# EasyEDA Pro project ProPrj_Electric_Dog.epro

# Schematic Schematic1
Board Name: Board1; Create Date: 2024-09-04
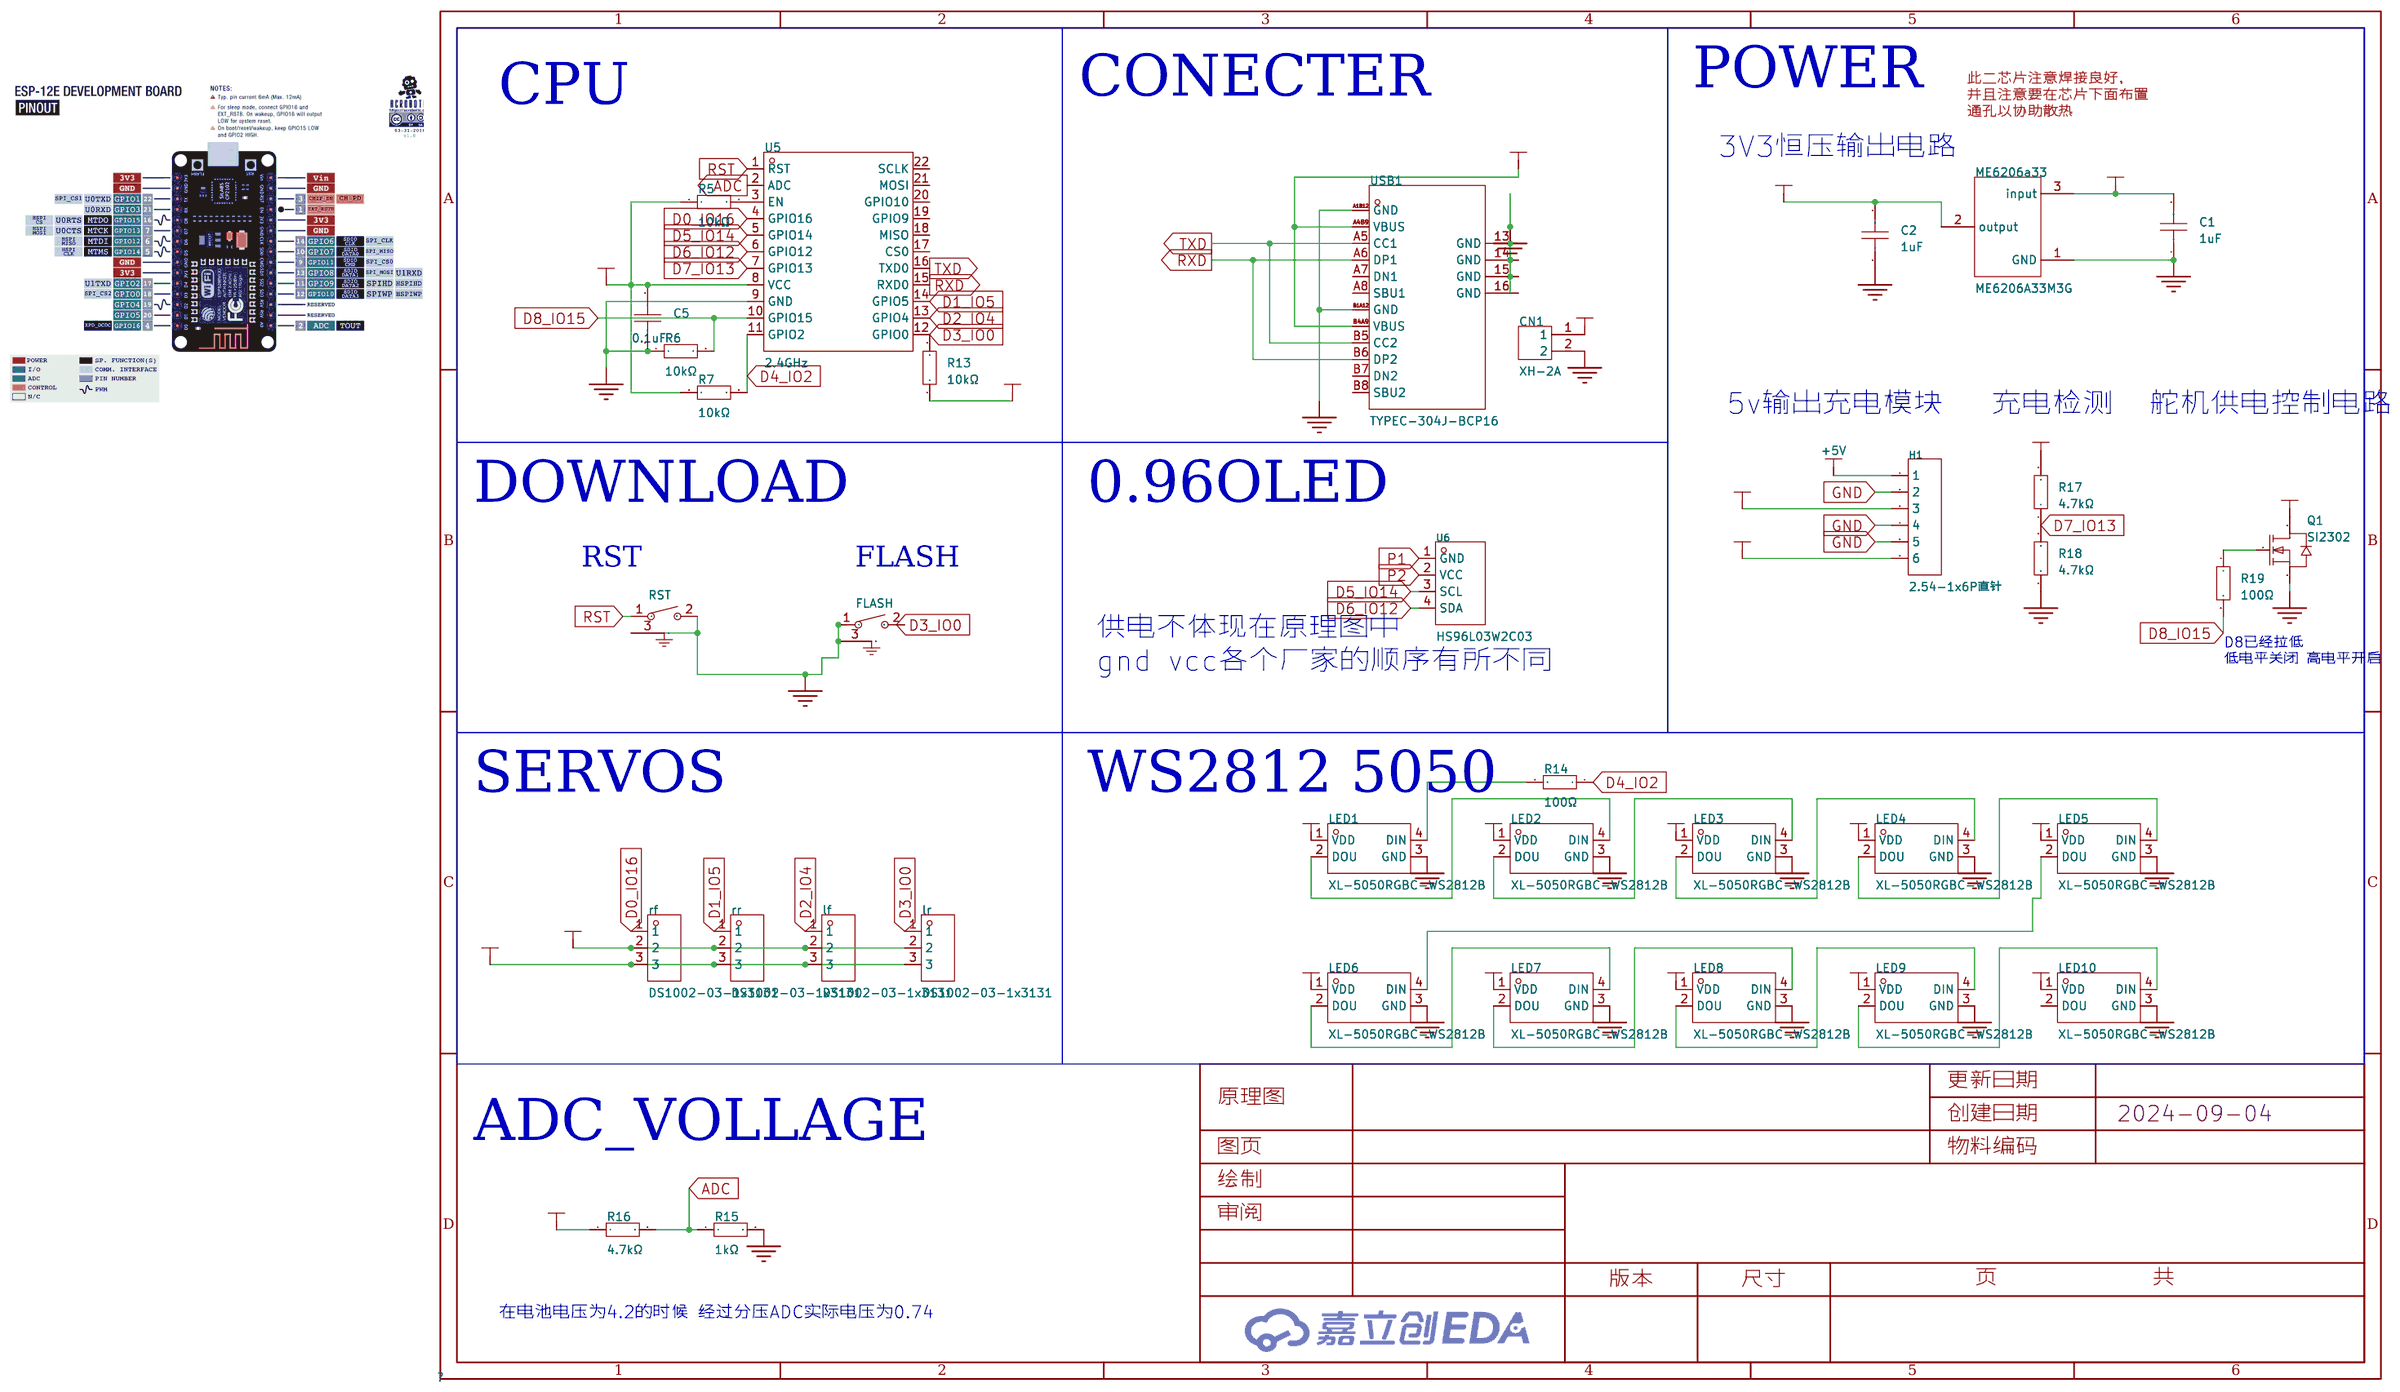
[diagram p0: schematic sheet]

## Parts
C1  1uF  [C0603]
C2  1uF  [C0603]
C5  0.1uF  [C0603]
CN1  XH-2A  [CONN-TH_XH-2A]
FLASH  TS-1091B-A8B3-D2  [KEY-TH_L4.5-W6.5-P3.10_TS-1091B-A8B3-D2]
H1  2.54-1x6P直针  [HDR-TH_6P-P2.54-V-M-1]
LED1  XL-5050RGBC-WS2812B  [LED-SMD_4P-L5.0-W5.0-BL_XL-5050RGBC]
LED2  XL-5050RGBC-WS2812B  [LED-SMD_4P-L5.0-W5.0-BL_XL-5050RGBC]
LED3  XL-5050RGBC-WS2812B  [LED-SMD_4P-L5.0-W5.0-BL_XL-5050RGBC]
LED4  XL-5050RGBC-WS2812B  [LED-SMD_4P-L5.0-W5.0-BL_XL-5050RGBC]
LED5  XL-5050RGBC-WS2812B  [LED-SMD_4P-L5.0-W5.0-BL_XL-5050RGBC]
LED6  XL-5050RGBC-WS2812B  [LED-SMD_4P-L5.0-W5.0-BL_XL-5050RGBC]
LED7  XL-5050RGBC-WS2812B  [LED-SMD_4P-L5.0-W5.0-BL_XL-5050RGBC]
LED8  XL-5050RGBC-WS2812B  [LED-SMD_4P-L5.0-W5.0-BL_XL-5050RGBC]
LED9  XL-5050RGBC-WS2812B  [LED-SMD_4P-L5.0-W5.0-BL_XL-5050RGBC]
LED10  XL-5050RGBC-WS2812B  [LED-SMD_4P-L5.0-W5.0-BL_XL-5050RGBC]
lf  DS1002-03-1x3131  [HDR-TH_3P-P2.54-V-M-1]
lr  DS1002-03-1x3131  [HDR-TH_3P-P2.54-V-M-1]
ME6206a33  ME6206A33M3G  [SOT-23-3_L2.9-W1.6-P1.90-LS2.8-BR]
Q1  SI2302  [SOT-23-3_L2.9-W1.3-P1.90-LS2.4-BR]
R5  10kΩ  [R0603]
R6  10kΩ  [R0603]
R7  10kΩ  [R0603]
R13  10kΩ  [R0603]
R14  100Ω  [R0603]
R15  1kΩ  [R0603]
R16  4.7kΩ  [R0603]
R17  4.7kΩ  [R0603]
R18  4.7kΩ  [R0603]
R19  100Ω  [R0603]
rf  DS1002-03-1x3131  [HDR-TH_3P-P2.54-V-M-1]
rr  DS1002-03-1x3131  [HDR-TH_3P-P2.54-V-M-1]
RST  TS-1091B-A8B3-D2  [KEY-TH_L4.5-W6.5-P3.10_TS-1091B-A8B3-D2]
U5  2.4GHz  [WIFIM-SMD_ESP-12F-ESP8266MOD]
U6  HS96L03W2C03  [OLED-TH_L27.8-W27.2-P2.54_C9900033791]
USB1  TYPEC-304J-BCP16  [USB-C-SMD_TYPEC-304J-BCP16]

## Library data of the parts
C1 C2 = CL10A105KB8NNNC: 容值:1uF;精度:±10%;额定电压:50V;材质(温度系数):X5R;; LCSC Part Name: 1uF ±10% 50V; Supplier Part: C15849; Manufacturer: SAMSUNG(三星); Supplier Footprint: 0603; JLCPCB Part Class: 基础库; Datasheet: https://atta.szlcsc.com/upload/public/pdf/source/20160218/1457707763339.pdf; Supplier: LCSC; Tolerance: ±10%; Voltage Rated: 50V; Temperature Coefficient: X5R
C5 = 0603BB104K500NGT: 容值:0.1uF;精度:±10%;额定电压:50V;温度系数:-;; LCSC Part Name: 0.1uF ±10% 50V; Supplier Part: C2168571; Manufacturer: Knowles(楼氏); Supplier Footprint: 0603; JLCPCB Part Class: 扩展库; Datasheet: https://atta.szlcsc.com/upload/public/pdf/source/20210426/55B82DB4A9EC19DEFEE13887341FCC08.pdf; Supplier: LCSC; Tolerance: ±10%; Voltage Rated: 50V
CN1 = XH-2A_C20079: 插针结构:1x2P;间距:2.5mm;安装方式:-;参考系列:XH;总PIN数:2P;排数:1;每排PIN数:2;行距:-;触头材质:-;; LCSC Part Name: 系列:XH 间距:2.5mm 1x2P; Supplier Part: C20079; Manufacturer: BOOMELE(博穆精密); Supplier Footprint: 插件,P=2.5mm; JLCPCB Part Class: 扩展库; Datasheet: https://atta.szlcsc.com/upload/public/pdf/source/20151225/1457707654857.pdf; Supplier: LCSC; Pins Structure: 1x2P; Pitch: 2.5mm; Reference Series: XH; Number of Pins: 2P; Number of Rows: 1; Number of PINs Per Row: 2
FLASH RST = TS-1091B-A8B3-D2: 电路结构:单刀单掷;安装方式:卧插;作用力:250gf@±30gf;机械寿命:-;带支架:否;; LCSC Part Name: 4.5*4.5*7mm 卧插 轻触开关; Supplier Part: C557914; Manufacturer: Yuandi(元迪); Supplier Footprint: 插件; JLCPCB Part Class: Extended Part; Datasheet: https://atta.szlcsc.com/upload/public/pdf/source/20200522/C557907_5E276C0BAE06263EE04F5DF3713DC068.pdf; Supplier: LCSC; Circuit: 单刀单掷; Mounting Style: 卧插; Actuator Style: 圆形按钮; Actuator/Cap Color: 黑色; Operating Force: 250gf@±30gf; Pin Style: PC引脚; Switch Length: 4.5mm; Switch Width: 4.5mm; Switch Height: 7mm; Strike Gundam: 否
H1 = 2.54-1x6P直针: 插针结构:1x6P;间距:2.54mm;行距:-;圆针/方针:方针;安装类型:直插;排数:单排;总PIN位数:6P;额定电流:3A;额定电压:-;配合针长度:-;塑高:-;触头材质:黄铜;触头镀层:-;工作温度范围:-40℃~+105℃;颜色:黑色;; LCSC Part Name: 间距:2.54mm 1x6P 直插 方针; Supplier Part: C37208; Manufacturer: BOOMELE(博穆精密); Supplier Footprint: 插件,P=2.54mm; JLCPCB Part Class: 扩展库; Supplier: LCSC; Pin Structure: 1x6P; Pitch: 2.54mm; Circluar Pins/Square Pins: 方针; Mounting Type: 直插; Number of Rows: 单排; Number of Pins: 6P; Current Rating (Max): 3A; Contact Material: 黄铜; Operating Temperature Range: -40℃~+105℃; Color: 黑色
LED1-LED10 = XL-5050RGBC-WS2812B: 5050七彩幻彩透明贴片LED灯珠 5050 幻彩透明四脚 ws2812B 内置驱动IC; Supplier Part: C2843785; Manufacturer: XINGLIGHT(成兴光); Supplier Footprint: SMD5050; JLCPCB Part Class: 扩展库; Datasheet: https://atta.szlcsc.com/upload/public/pdf/source/20240412/E1004CAA80592E31D08BFE019083806F.pdf; Supplier: LCSC
lf lr rf rr = DS1002-03-1x3131: 端子镀锡150u\"六爪镀金; Supplier Part: C7495244; Manufacturer: CONNFLY; Supplier Footprint: SIP-3; JLCPCB Part Class: 扩展库; Datasheet: https://atta.szlcsc.com/upload/public/pdf/source/20240329/0C4791BFD3969CFF9B8FE77E23916C14.pdf; Supplier: LCSC
ME6206a33 = ME6206A33M3G: 输出类型:固定;输出极性:正;最大输入电压:6V;输出电压:3.3V;输出电流:300mA;电源纹波抑制比(PSRR):50dB@(1kHz);; Supplier Part: C35259; Manufacturer: MICRONE(南京微盟); Supplier Footprint: SOT-23-3L; JLCPCB Part Class: 扩展库; Datasheet: https://atta.szlcsc.com/upload/public/pdf/source/20171014/C35259_15079757490131038524.pdf; Supplier: LCSC; Output Type: 固定; Output Polarity: 正; Number of Outputs: 1; Maximum Input Voltage: 6V; Output Voltage: 3.3V; Dropout Voltage: 380mV@(200mA); Output Current: 300mA; Power Supply Rejection Ratio (PSRR): 50dB@(1kHz)
Q1 = SI2302-HXY: 类型:1个N沟道;漏源电压(Vdss):20V;连续漏极电流(Id):2.8A;功率(Pd):900mW;导通电阻(RDS(on)@Vgs,Id):55mΩ@4.5V,2.8A;阈值电压(Vgs(th)@Id):1.2V@250uA;; LCSC Part Name: 1个N沟道 耐压:20V 电流:2.8A; Supplier Part: C4748714; Manufacturer: HXY MOSFET(华轩阳电子); Supplier Footprint: SOT-23; JLCPCB Part Class: 扩展库; Datasheet: https://atta.szlcsc.com/upload/public/pdf/source/20220720/B2EC63D46AD65363D9D3692163B46869.pdf; Supplier: LCSC; Type: 1个N沟道; Drain Source Voltage (Vdss): 20V; Continuous Drain Current (Id): 2.8A; Power Dissipation (Pd): 900mW; Drain Source On Resistance (RDS(on)@Vgs,Id): 55mΩ@4.5V,2.8A; Gate Threshold Voltage (Vgs(th)@Id): 1.2V@250uA; Input Capacitance (Ciss@Vds): 260pF@10V
R5-R7 R13 = 0603WAF1002T5E: 电阻类型:厚膜电阻;阻值:10kΩ;精度:±1%;功率:100mW;; LCSC Part Name: 厚膜电阻 10kΩ ±1% 100mW; Supplier Part: C25804; Manufacturer: UNI-ROYAL(厚声); Supplier Footprint: 0603; JLCPCB Part Class: Basic Part; Datasheet: https://atta.szlcsc.com/upload/public/pdf/source/20200306/C422600_1E6D84923E4A46A82E41ADD87F860B5C.pdf; Supplier: LCSC; Type: 厚膜电阻; Tolerance: ±1%; Power(Watts): 100mW; Temperature Coefficient: ±100ppm/℃; Overload Voltage (Max): 75V; Operating Temperature Range: -55℃~+155℃
R14 R19 = 0603WAF1000T5E: 电阻类型:厚膜电阻;阻值:100Ω;精度:±1%;功率:100mW;最大工作电压:75V;温度系数:±200ppm/℃;; LCSC Part Name: 100Ω ±1% 100mW 厚膜电阻; Supplier Part: C22775; Manufacturer: UNI-ROYAL(厚声); Supplier Footprint: 0603; JLCPCB Part Class: 基础库; Datasheet: https://atta.szlcsc.com/upload/public/pdf/source/20200306/C422600_1E6D84923E4A46A82E41ADD87F860B5C.pdf; Supplier: LCSC; Type: 厚膜电阻; Tolerance: ±1%; Power(Watts): 100mW; Overload Voltage (Max): 75V; Temperature Coefficient: ±200ppm/℃; Operating Temperature Range: -55℃~+155℃
R15 = 0603WAF1001T5E: 电阻类型:厚膜电阻;阻值:1kΩ;精度:±1%;功率:100mW;; LCSC Part Name: 1kΩ ±1% 100mW; Supplier Part: C21190; Manufacturer: UNI-ROYAL(厚声); Supplier Footprint: 0603; JLCPCB Part Class: Basic Part; Datasheet: https://atta.szlcsc.com/upload/public/pdf/source/20200306/C422600_1E6D84923E4A46A82E41ADD87F860B5C.pdf; Supplier: LCSC; Type: 厚膜电阻; Tolerance: ±1%; Power(Watts): 100mW; Temperature Coefficient: ±100ppm/℃; Overload Voltage (Max): 75V; Operating Temperature Range: -55℃~+155℃
R16-R18 = 0603WAF4701T5E: 电阻类型:厚膜电阻;阻值:4.7kΩ;精度:±1%;功率:100mW;最大工作电压:75V;温度系数:±100ppm/℃;; LCSC Part Name: 4.7kΩ ±1% 100mW 厚膜电阻; Supplier Part: C23162; Manufacturer: UNI-ROYAL(厚声); Supplier Footprint: 0603; JLCPCB Part Class: 基础库; Datasheet: https://atta.szlcsc.com/upload/public/pdf/source/20200306/C422600_1E6D84923E4A46A82E41ADD87F860B5C.pdf; Supplier: LCSC; Type: 厚膜电阻; Tolerance: ±1%; Power(Watts): 100mW; Overload Voltage (Max): 75V; Temperature Coefficient: ±100ppm/℃; Operating Temperature Range: -55℃~+155℃
U5 = ESP-12F(ESP8266MOD): 频率:2.4GHz;发射功率:16dBm;核心处理器:ESP8266;天线形式:PCB 板载天线;接收灵敏度:-90dBm;; LCSC Part Name: 完整的802.11b/g/nWi-Fi的SoC模块; Supplier Part: C82891; Manufacturer: Ai-Thinker(安信可); Supplier Footprint: SMD,16x24mm; JLCPCB Part Class: ExtendedPart; Datasheet: https://atta.szlcsc.com/upload/public/pdf/source/20210219/C82891_ABD84A460F4F056A2757267CCCA4B508.pdf; Supplier: LCSC; Output Power: 16dBm; Core Processor: ESP8266; Support Interface: GPIO；UART；I2C；PWM；SPI；ADC; Antenna Type: PCB板载天线; Wireless Standard: 802.11b/g/n; Operating Voltage: 3.3V; Receive  Current: 120mA; Send  Current: 170mA; Sensitivity: -90dBm; Operating Temperature: -40℃~+85℃
U6 = HS96L03W2C03: 尺寸(inch)：0.96寸 0.96' 像素分辨率：128x64 128*64主控芯片：SSD1315 接口类型：I2C 外形:27.3*27.8；IIC/3SPI/4SPI串口通讯,工作温度范围-40℃—+70℃。4PIN黑底白光。; LCSC Part Name: 0.96寸OLED显示屏窄白光IIC; Supplier Part: C5248080; Manufacturer: HS(汉昇); JLCPCB Part Class: Extended Part; Datasheet: https://atta.szlcsc.com/upload/public/pdf/source/20230627/763D01F79A90007632F098068C7C8AD9.pdf; Supplier: LCSC
USB1 = TYPEC-304J-BCP16: 连接器类型:Type-C;标准:USB 3.1;公母:母座;触点数量:16;端口数量:1;安装方式:卧贴;额定电流 - 电源:5A;工作温度范围:-40℃~+85℃;焊接温度(最大值):260℃;; LCSC Part Name: Type-C母座卧贴脚长2.0; Supplier Part: C2835315; Manufacturer: XUNPU(讯普); Supplier Footprint: SMD; JLCPCB Part Class: ExtendedPart; Datasheet: https://atta.szlcsc.com/upload/public/pdf/source/20210528/C2835315_A76BD3CF9329D12B6041421AD23BFD66.pdf; Supplier: LCSC; Connector Type: Type-C; Standard: USB3.1; Gender: 母座; Number of Contacts: 16; Number of Ports: 1; Mounting Style: 卧贴; Current Rating - Power (Max): 5A; Operating Temperature Range: -40℃~+85℃; Welding Temperature (Max): 260℃

## Nets
3V3: C2.2 C5.2 LED1.1(VDD) LED2.1(VDD) LED3.1(VDD) LED4.1(VDD) LED5.1(VDD) LED6.1(VDD) LED7.1(VDD) LED8.1(VDD) LED9.1(VDD) LED10.1(VDD) ME6206a33.2(output) R5.1 R7.1 R13.1 U5.8(VCC)
+5V: H1.1
GND: C1.1 C2.1 C5.1 CN1.2 FLASH.1 FLASH.3(GND) H1.2 H1.4 H1.5 LED1.3(GND) LED2.3(GND) LED3.3(GND) LED4.3(GND) LED5.3(GND) LED6.3(GND) LED7.3(GND) LED8.3(GND) LED9.3(GND) LED10.3(GND) ME6206a33.1(GND) Q1.2(S) R6.1 R15.2 R18.1 RST.2 RST.3(GND) U5.9(GND) USB1.13(GND) USB1.14(GND) USB1.15(GND) USB1.16(GND) USB1.A1B12(GND) USB1.B1A12(GND)
VIN: H1.6 R17.2 USB1.A4B9(VBUS) USB1.B4A9(VBUS)
ADC: R15.1 R16.2 U5.2(ADC)
BATTERY+: C1.2 CN1.1 H1.3 lf.2 lr.2 ME6206a33.3(input) R16.1 rf.2 rr.2
D0_IO16: rf.1 U5.4(GPIO16)
D1_IO5: rr.1 U5.14(GPIO5)
D2_IO4: lf.1 U5.13(GPIO4)
D3_IO0: FLASH.2 lr.1 R13.2 U5.12(GPIO0)
D4_IO2: R7.2 R14.1 U5.11(GPIO2)
D5_IO14: U5.5(GPIO14) U6.3(SCL)
D6_IO12: U5.6(GPIO12) U6.4(SDA)
D7_IO13: R17.1 R18.2 U5.7(GPIO13)
D8_IO15: R6.2 R19.2 U5.10(GPIO15)
P1: U6.1(GND)
P2: U6.2(VCC)
RST: RST.1 U5.1(RST)
RXD: U5.15(RXD0) USB1.A6(DP1) USB1.B6(DP2)
SERVOS_POWER: lf.3 lr.3 Q1.3(D) rf.3 rr.3
TXD: U5.16(TXD0) USB1.A5(CC1) USB1.B5(CC2)
$1N396: R5.2 U5.3(EN)
$1N3573: LED1.2(DOU) LED2.4(DIN)
$1N3873: LED2.2(DOU) LED3.4(DIN)
$1N3945: LED3.2(DOU) LED4.4(DIN)
$1N4017: LED4.2(DOU) LED5.4(DIN)
$1N4422: LED5.2(DOU) LED6.4(DIN)
$1N4734: LED6.2(DOU) LED7.4(DIN)
$1N4744: LED7.2(DOU) LED8.4(DIN)
$1N4754: LED8.2(DOU) LED9.4(DIN)
$1N4764: LED9.2(DOU) LED10.4(DIN)
$1N4854: LED1.4(DIN) R14.2
$1N12611: Q1.1(G) R19.1

Not connected (* = marked no-connect by the designer): LED10 2(DOU); U5 17(CS0) 18(MISO) 19(GPIO9) 20(GPIO10) 21(MOSI) 22(SCLK); USB1 A7(DN1) A8(SBU1) B7(DN2) B8(SBU2)

## Notes on the sheet
- CONECTER
- POWER
- CPU
- 此二芯片注意焊接良好，
  并且注意要在芯片下面布置
  通孔以协助散热
- 3V3恒压输出电路
- 5v输出充电模块
- 充电检测
- 舵机供电控制电路
- DOWNLOAD
- 0.96OLED
- RST
- FLASH
- D8已经拉低
  低电平关闭 高电平开启
- 供电不体现在原理图中
  gnd vcc各个厂家的顺序有所不同
- SERVOS
- WS2812 5050
- ADC_VOLLAGE
- 在电池电压为4.2的时候 经过分压ADC实际电压为0.74

# Board PCB1
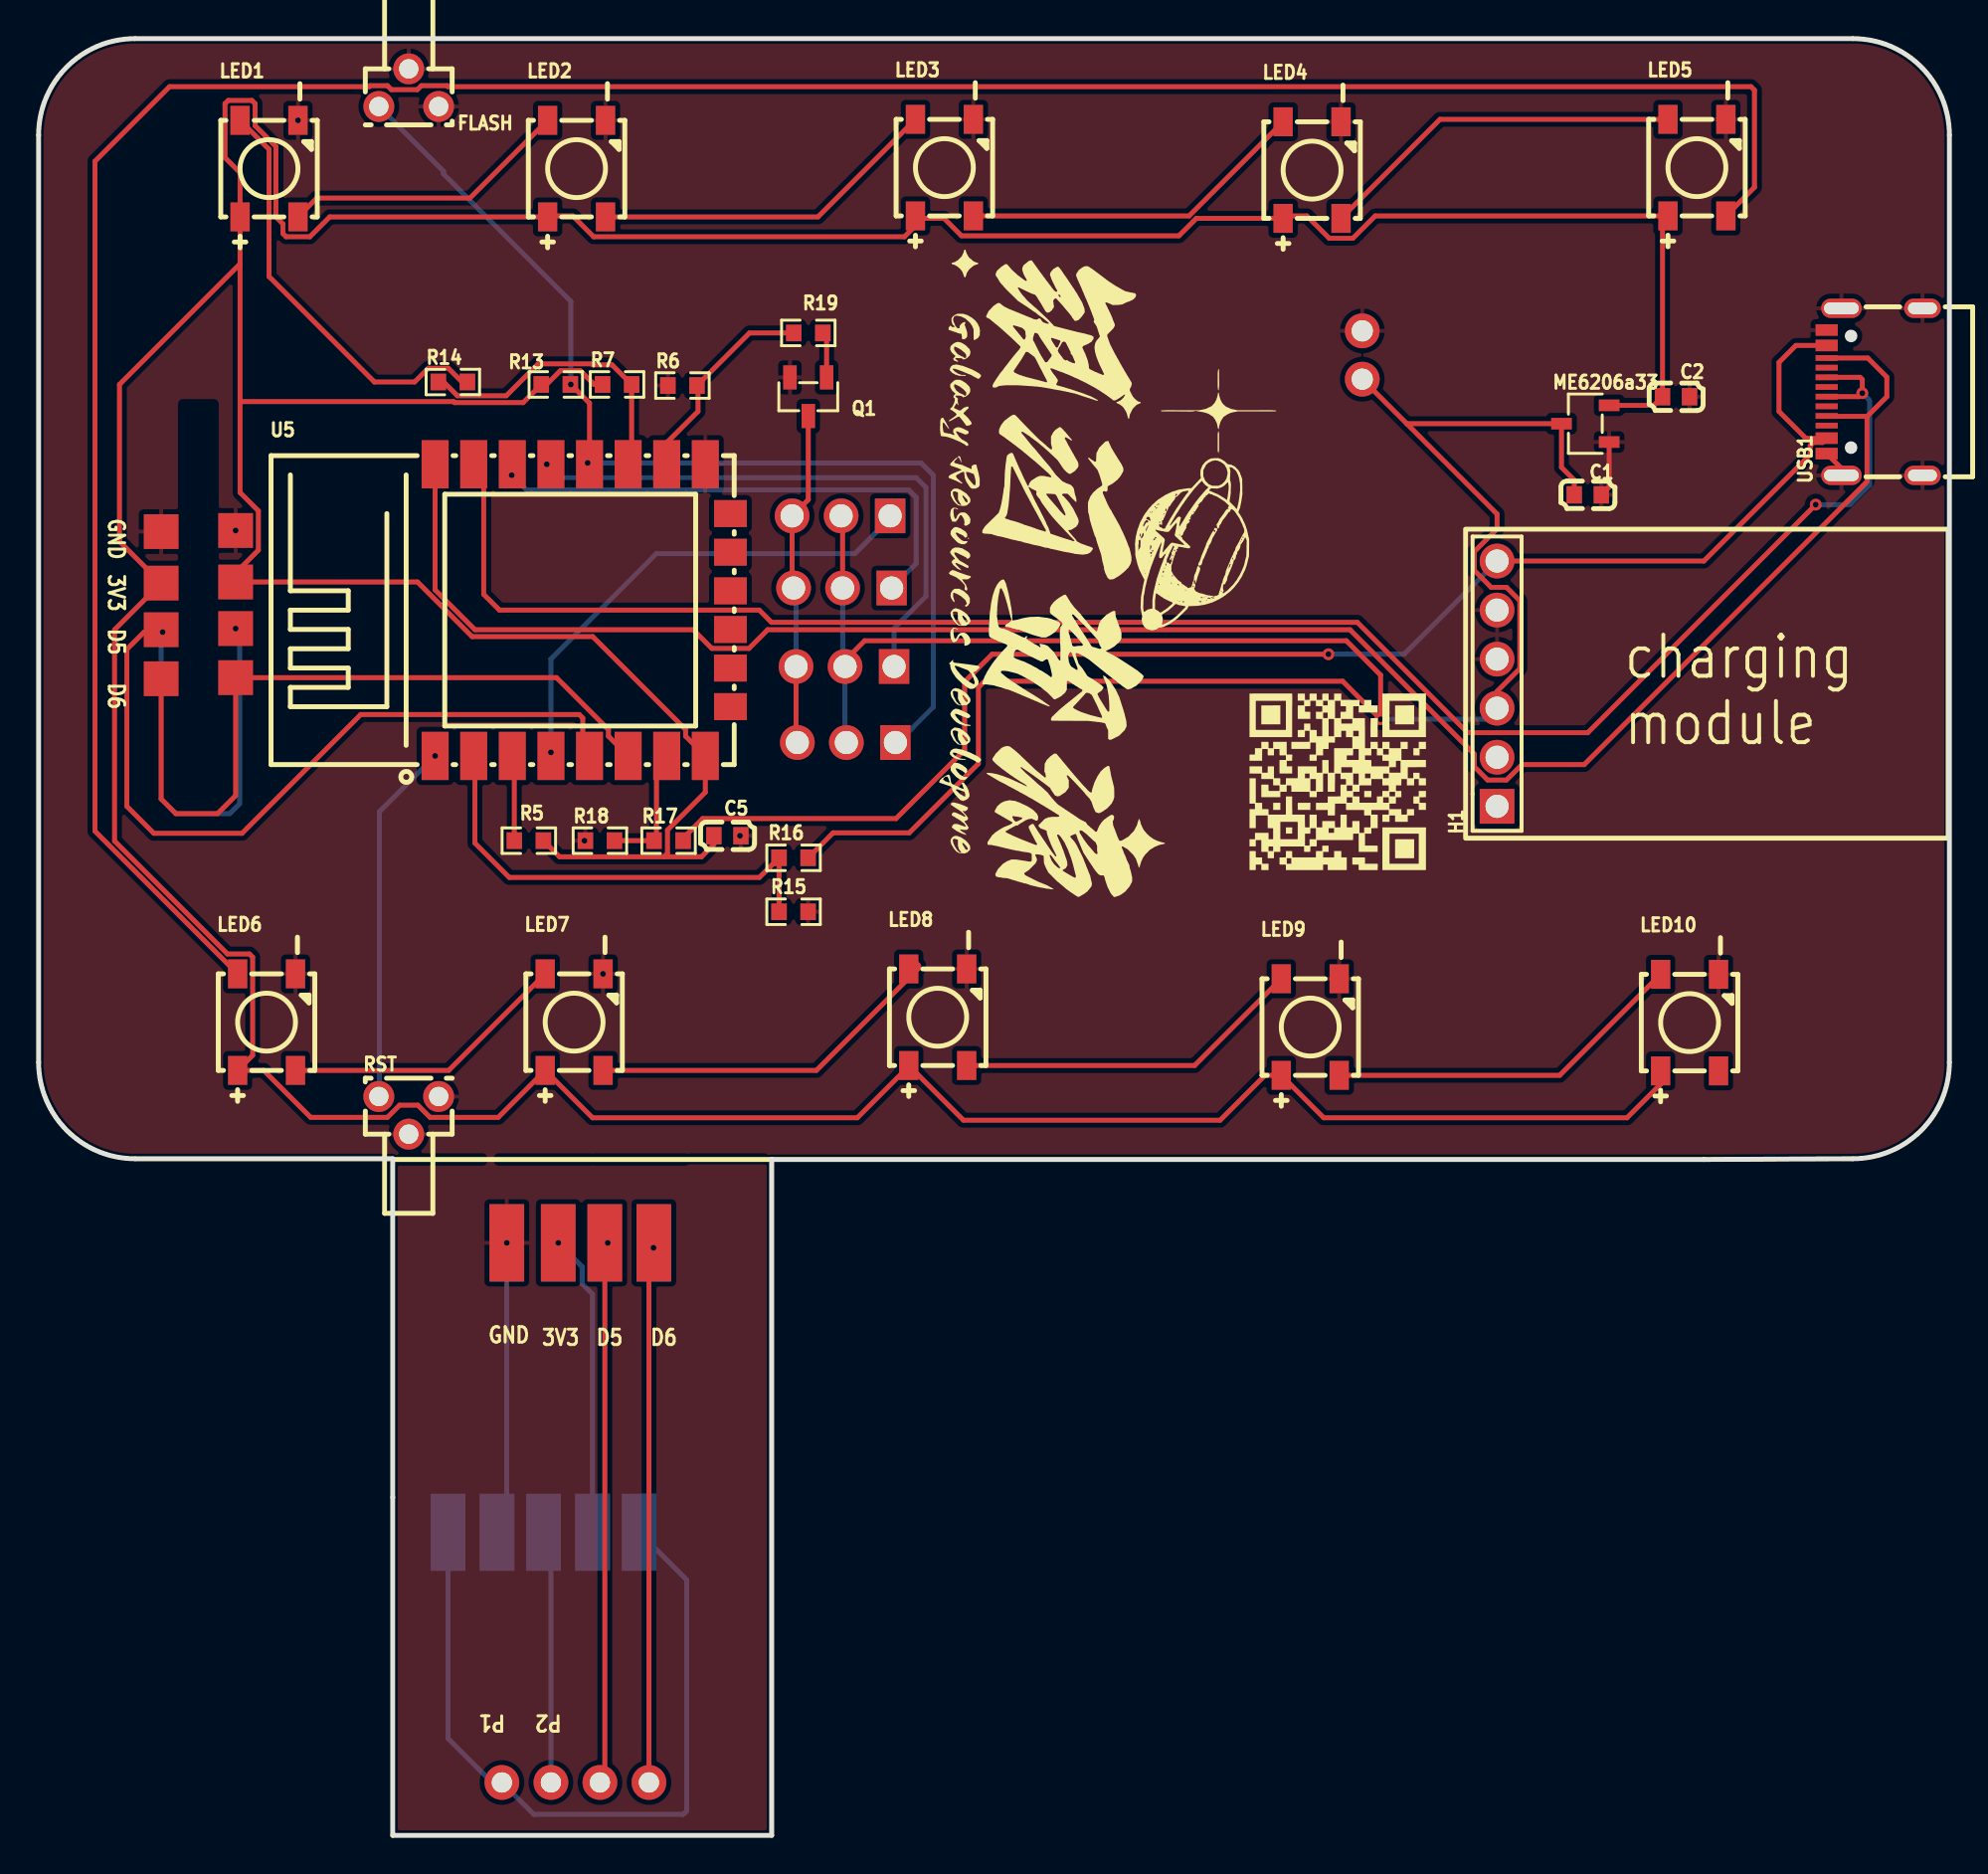
[diagram p1: board, top side]
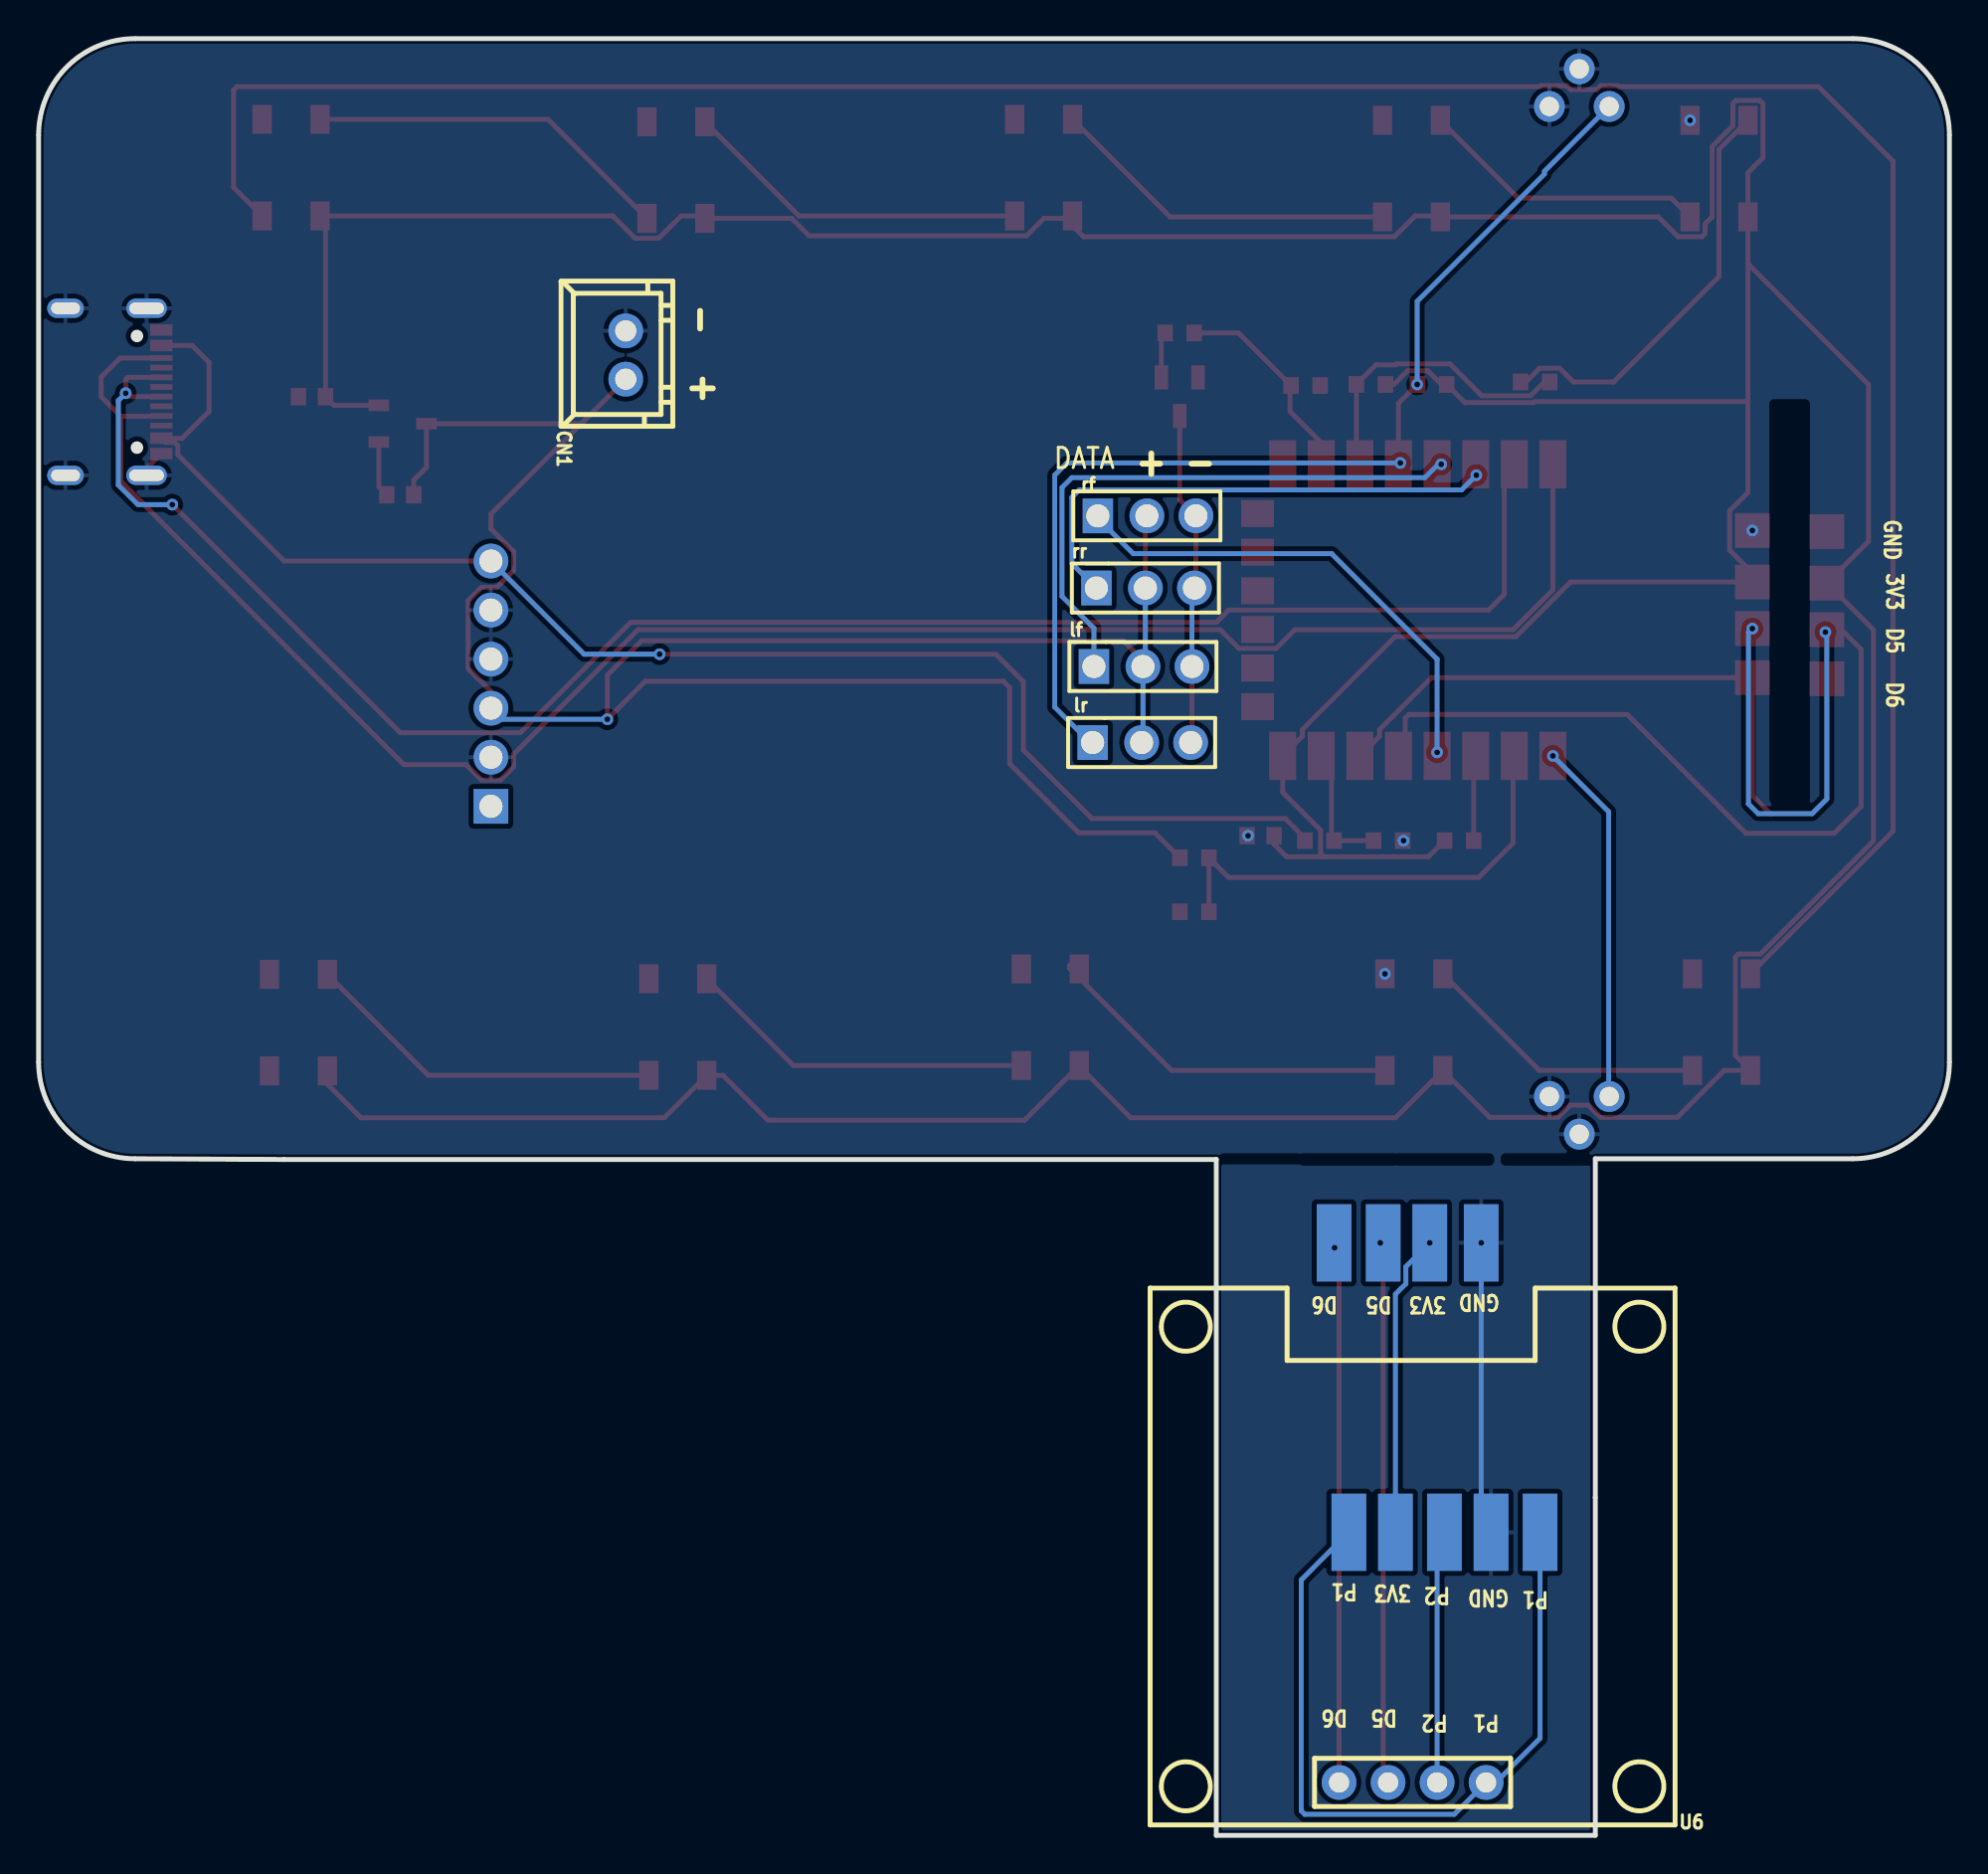
[diagram p2: board, bottom side, seen from below]

Outline 99 x 93.04 mm; copper layers: Top Layer, Bottom Layer. Coordinates in mm from the lower left corner of the outline.
Outline path: 0,88.04 arc(1.46,91.57) 5,93.04 94,93.04 arc(97.54,91.57) 99,88.04 99,40.04 arc(97.54,36.5) 94,35.04 86.29,35 37.98,35 37.98,0 18.35,0 18.35,35.04 5,35.04 arc(1.46,36.5) 0,40.04 0,88.04
Stack: Top Layer 0.035mm / Dielectric1 1.51mm FR4 er 4.5 / Bottom Layer 0.035mm

## Design rules (mm)
template: JLCPCB Capability(Two Layers Board)
spacing copperThickness1oz (default): track to track 0.102, other pairs 0.152 to 0.3
spacing copperThickness2oz: track to track 0.203, other pairs 0.152 to 0.3
track width copperThickness1oz (default): min 0.127, default 0.254, max 2.54
track width copperThickness2oz: min 0.203, default 0.254, max 2.54
differential pair differentialPair (default): width min 0.127, default 0.254, max 2.54; gap min 0.152, default 0.152
via viaSize (default): diameter min 0.5, default 0.61, max 10; hole min 0.3, default 0.305, max 6.3

## Placement (name value [footprint] x y rotation side)
C1  1uF  [C0603]  80.26 69.42 180 top
C2  1uF  [C0603]  84.84 74.5 180 top
C5  0.1uF  [C0603]  35.69 51.76 180 top
CN1  XH-2A  [CONN-TH_XH-2A]  68.58 76.65 90 bottom
FLASH  TS-1091B-A8B3-D2  [KEY-TH_L4.5-W6.5-P3.10_TS-1091B-A8B3-D2]  19.18 90.5 180 top
H1  2.54-1x6P直针  [HDR-TH_6P-P2.54-V-M-1]  75.56 59.64 90 top
LED1  XL-5050RGBC-WS2812B  [LED-SMD_4P-L5.0-W5.0-BL_XL-5050RGBC]  11.94 86.31 0 top
LED2  XL-5050RGBC-WS2812B  [LED-SMD_4P-L5.0-W5.0-BL_XL-5050RGBC]  27.87 86.31 0 top
LED3  XL-5050RGBC-WS2812B  [LED-SMD_4P-L5.0-W5.0-BL_XL-5050RGBC]  46.93 86.36 0 top
LED4  XL-5050RGBC-WS2812B  [LED-SMD_4P-L5.0-W5.0-BL_XL-5050RGBC]  65.98 86.23 0 top
LED5  XL-5050RGBC-WS2812B  [LED-SMD_4P-L5.0-W5.0-BL_XL-5050RGBC]  85.92 86.36 0 top
LED6  XL-5050RGBC-WS2812B  [LED-SMD_4P-L5.0-W5.0-BL_XL-5050RGBC]  11.81 42.11 0 top
LED7  XL-5050RGBC-WS2812B  [LED-SMD_4P-L5.0-W5.0-BL_XL-5050RGBC]  27.75 42.11 0 top
LED8  XL-5050RGBC-WS2812B  [LED-SMD_4P-L5.0-W5.0-BL_XL-5050RGBC]  46.58 42.36 0 top
LED9  XL-5050RGBC-WS2812B  [LED-SMD_4P-L5.0-W5.0-BL_XL-5050RGBC]  65.88 41.86 0 top
LED10  XL-5050RGBC-WS2812B  [LED-SMD_4P-L5.0-W5.0-BL_XL-5050RGBC]  85.54 42.09 0 top
lf  DS1002-03-1x3131  [HDR-TH_3P-P2.54-V-M-1]  41.78 60.53 180 bottom
lr  DS1002-03-1x3131  [HDR-TH_3P-P2.54-V-M-1]  41.85 56.59 180 bottom
ME6206a33  ME6206A33M3G  [SOT-23-3_L2.9-W1.6-P1.90-LS2.8-BR]  80.14 73.1 0 top
NOREF  -  [Pad_e440]  29.34 30.68 90 top
NOREF#2  -  [Pad_e446]  31.88 30.68 90 top
NOREF#3  -  [Pad_e88]  10.21 64.9 0 top
NOREF#4  -  [Pad_e432]  6.35 67.51 0 top
NOREF#5  -  [Pad_e89]  10.21 62.49 0 top
NOREF#6  -  [Pad_e436]  6.35 59.89 0 top
NOREF#7  -  [Pad_e472]  28.7 15.69 90 top
NOREF#8  -  [Pad_e438]  24.26 30.68 90 top
NOREF#9  -  [Pad_e441]  31.88 30.68 90 top
NOREF#10  -  [Pad_e467]  23.75 15.69 90 top
NOREF#11  -  [Pad_e473]  26.16 15.69 90 top
NOREF#12  -  [Pad_e474]  31.12 15.69 90 top
NOREF#13  -  [Pad_e434]  6.35 64.84 0 top
NOREF#14  -  [Pad_e90]  10.21 59.95 0 top
NOREF#15  -  [Pad_e87]  10.21 67.57 0 top
NOREF#16  -  [Pad_e447]  26.92 30.68 90 top
NOREF#17  -  [Pad_e444]  24.26 30.68 90 top
NOREF#18  -  [Pad_e445]  29.34 30.68 90 top
NOREF#19  -  [Pad_e466]  21.21 15.69 90 top
NOREF#20  -  [Pad_e439]  26.92 30.68 90 top
NOREF#21  -  [Pad_e435]  6.35 62.43 0 top
Q1  SI2302  [SOT-23-3_L2.9-W1.3-P1.90-LS2.4-BR]  39.88 74.5 90 top
R5  10kΩ  [R0603]  25.4 51.51 180 top
R6  10kΩ  [R0603]  33.36 75.07 0 top
R7  10kΩ  [R0603]  29.97 75.13 0 top
R13  10kΩ  [R0603]  26.8 75.13 0 top
R14  100Ω  [R0603]  21.46 75.26 0 top
R15  1kΩ  [R0603]  39.12 47.83 0 top
R16  4.7kΩ  [R0603]  39.12 50.62 180 top
R17  4.7kΩ  [R0603]  32.64 51.51 0 top
R18  4.7kΩ  [R0603]  29.08 51.51 0 top
R19  100Ω  [R0603]  39.88 77.8 180 top
rf  DS1002-03-1x3131  [HDR-TH_3P-P2.54-V-M-1]  41.58 68.33 180 bottom
rr  DS1002-03-1x3131  [HDR-TH_3P-P2.54-V-M-1]  41.66 64.59 180 bottom
RST  TS-1091B-A8B3-D2  [KEY-TH_L4.5-W6.5-P3.10_TS-1091B-A8B3-D2]  19.18 37.28 0 top
U5  2.4GHz  [WIFIM-SMD_ESP-12F-ESP8266MOD]  28.19 63.45 0 top
U6  HS96L03W2C03  [OLED-TH_L27.8-W27.2-P2.54_C9900033791]  27.81 2.74 0 bottom
USB1  TYPEC-304J-BCP16  [USB-C-SMD_TYPEC-304J-BCP16]  95.12 74.75 90 top

## Footprints (pads in the part's own frame, mm; a bottom-side part is the same pattern mirrored in y, then rotated)
C0603
  rect 0.8x0.9 smd: 1(-0.7,0) 2(0.7,0)
CONN-TH_XH-2A
  round 1.8 hole 1.1: 1(-1.251,0) 2(1.251,0)
HDR-TH_3P-P2.54-V-M-1
  rect 1.575x1.8 hole 1.2: 1(-2.54,0)
  round 1.8 hole 1.2: 2(0,0) 3(2.54,0)
HDR-TH_6P-P2.54-V-M-1
  rect 1.8x1.8 hole 1.2: 1(-6.35,0)
  round 1.8 hole 1.2: 2(-3.81,0) 3(-1.27,0) 4(1.27,0) 5(3.81,0) 6(6.35,0)
KEY-TH_L4.5-W6.5-P3.10_TS-1091B-A8B3-D2
  round 1.6 hole 1: 1(-1.55,0.975) 2(1.55,0.975) 3(0,-0.975)
LED-SMD_4P-L5.0-W5.0-BL_XL-5050RGBC
  rect 1x1.5 smd: 1(-1.5,-2.5) 2(1.5,-2.5) 3(1.5,2.5) 4(-1.5,2.5)
OLED-TH_L27.8-W27.2-P2.54_C9900033791
  round 1.8 hole 1.05: 1(-3.81,0) 2(-1.27,0) 3(1.27,0) 4(3.81,0)
Pad_e87
  rect 1.8x1.8 smd: 1(0,0)
Pad_e88
  rect 1.8x1.8 smd: 1(0,0)
Pad_e89
  rect 1.8x1.8 smd: 1(0,0)
Pad_e90
  rect 1.8x1.8 smd: 1(0,0)
Pad_e432
  rect 1.8x1.8 smd: 1(0,0)
Pad_e434
  rect 1.8x1.8 smd: 1(0,0)
Pad_e435
  rect 1.8x1.8 smd: 1(0,0)
Pad_e436
  rect 1.8x1.8 smd: 1(0,0)
Pad_e438
  rect 4x1.8 smd: 1(0,0)
Pad_e439
  rect 4x1.8 smd: 1(0,0)
Pad_e440
  rect 4x1.8 smd: 1(0,0)
Pad_e441
  rect 4x1.8 smd: 1(0,0)
Pad_e444
  rect 4x1.8 smd far side: 1(0,0)
Pad_e445
  rect 4x1.8 smd far side: 1(0,0)
Pad_e446
  rect 4x1.8 smd far side: 1(0,0)
Pad_e447
  rect 4x1.8 smd far side: 1(0,0)
Pad_e466
  rect 4x1.8 smd far side: 1(0,0)
Pad_e467
  rect 4x1.8 smd far side: 1(0,0)
Pad_e472
  rect 4x1.8 smd far side: 1(0,0)
Pad_e473
  rect 4x1.8 smd far side: 1(0,0)
Pad_e474
  rect 4x1.8 smd far side: 1(0,0)
R0603
  rect 0.806x0.864 smd: 1(-0.753,0) 2(0.753,0)
SOT-23-3_L2.9-W1.3-P1.90-LS2.4-BR
  rect 1.25x0.7 smd: 1(1,-0.95) 2(1,0.95) 3(-1,0)
SOT-23-3_L2.9-W1.6-P1.90-LS2.8-BR
  rect 1.07x0.6 smd: 1(1.235,-0.95) 2(1.235,0.95) 3(-1.235,0)
USB-C-SMD_TYPEC-304J-BCP16
  oval 1x2.1 hole 0.6x1.8: 13(-4.325,1.718) 14(4.325,1.718)
  oval 1x1.9 hole 0.6x1.5: 15(-4.325,-2.482) 16(4.325,-2.482)
  rect 0.6x1.15 smd: A1B12(-3.2,2.482) A4B9(-2.4,2.482) B1A12(3.2,2.482) B4A9(2.4,2.482)
  rect 0.3x1.15 smd: A5(-1.25,2.482) A6(-0.25,2.482) A7(0.25,2.482) A8(1.25,2.482) B5(1.75,2.482) B6(0.75,2.482) B7(-0.75,2.482) B8(-1.75,2.482)
WIFIM-SMD_ESP-12F-ESP8266MOD
  rect 1.4x2.5 smd: 1(-7.651,-7.551) 2(-5.651,-7.551) 3(-3.651,-7.551) 4(-1.651,-7.551) 5(0.349,-7.551) 6(2.349,-7.551) 7(4.349,-7.551) 8(6.349,-7.551) 9(6.349,7.548) 10(4.349,7.55) 11(2.349,7.551) 12(0.349,7.551) 13(-1.651,7.55) 14(-3.651,7.551) 15(-5.651,7.551) 16(-7.651,7.551)
  rect 1.7x1.4 smd: 17(7.651,-5) 18(7.649,-3.002) 19(7.649,-1.004) 20(7.649,0.998) 21(7.649,2.997) 22(7.651,4.997)

## Nets
As in the schematic, except:
3V3: C2.2 C5.2 LED1.1 LED2.1 LED3.1 LED4.1 LED5.1 LED6.1 LED7.1 LED8.1 LED9.1 LED10.1 ME6206a33.2 NOREF#3.1 NOREF#7.1 NOREF#13.1 NOREF#16.1 NOREF#20.1 R5.1 R7.1 R13.1 U5.8
GND: C1.1 C2.1 C5.1 CN1.2 FLASH.1 FLASH.3 H1.2 H1.4 H1.5 LED1.3 LED2.3 LED3.3 LED4.3 LED5.3 LED6.3 LED7.3 LED8.3 LED9.3 LED10.3 ME6206a33.1 NOREF#4.1 NOREF#8.1 NOREF#10.1 NOREF#15.1 NOREF#17.1 Q1.2 R6.1 R15.2 R18.1 RST.2 RST.3 U5.9 USB1.13 USB1.14 USB1.15 USB1.16 USB1.A1B12 USB1.B1A12
D5_IO14: NOREF.1 NOREF#5.1 NOREF#18.1 NOREF#21.1 U5.5 U6.3
D6_IO12: NOREF#2.1 NOREF#6.1 NOREF#9.1 NOREF#14.1 U5.6 U6.4
P1: NOREF#12.1 NOREF#19.1 U6.1
P2: NOREF#11.1 U6.2

Pads without a net: LED10 2; U5 17 18 19 20 21 22; USB1 A7 A8 B7 B8

## Via types
v1: diameter 0.61, hole 0.305, Top Layer to Bottom Layer, 21 vias

## Routing (per net, layer and track width the routed paths; a pad name or vN(x,y) marks a point on that pad's centre or on a via; arc(x,y) is an arc through that point)
3V3: length 335.6
  Top Layer w0.254: 10.44,81.38 4.19,75.13 4.19,67 NOREF#13.1 3.94,62.43 3.94,51.49 9.79,45.64 10.93,45.64 11.09,45.48 11.09,40.39 LED6.1 11.67,39.61 14.1,37.18 18.07,37.18 18.71,37.81 19.65,37.81 20.28,37.18 23.82,37.18 LED7.1 28.7,37.16 42.42,37.16 45.08,39.82 LED8.1 47.92,37.03 61.21,37.03 63.54,39.36 LED9.1 66.58,37.16 82.3,37.16 84.04,38.9 LED10.1 ; 10.44,81.38 10.44,74.24 ; 10.44,81.38 LED1.1 10.44,86.09 9.66,86.87 9.66,89.67 9.82,89.84 11.05,89.84 11.22,89.67 11.22,88.53 12.29,87.45 12.29,83.81 12.66,83.44 12.66,82.94 12.82,82.78 14.05,82.78 15.08,83.81 LED2.1 26.42,83.86 27.68,83.86 28.76,82.78 44.86,82.78 45.43,83.35 LED3.1 45.56,83.73 46.91,83.73 47.81,82.83 59.08,82.83 59.98,83.73 LED4.1 64.61,83.86 65.71,83.86 66.86,82.7 68.1,82.7 69.25,83.86 LED5.1 84.14,83.57 C2.2 83.69,74.05 ME6206a33.2 ; 10.44,74.24 21.5,74.24 21.55,74.19 25.1,74.19 R13.1 26.32,75.13 27.03,75.84 28.07,75.84 28.78,75.13 R7.1 ; 10.44,74.24 10.44,69.53 11.39,68.58 11.39,66.55 10.44,65.6 10.44,65.13 NOREF#3.1 19.63,64.9 22.46,62.07 28.71,62.07 33.52,57.26 33.52,56.92 U5.8 34.54,54.02 32.58,52.06 32.58,50.85 32.4,50.67 ; 32.4,50.67 34.34,50.67 34.99,51.32 C5.2 ; 32.4,50.67 26.99,50.67 R5.1
  Bottom Layer w0.254: NOREF#7.1 28.7,28.02 28.16,28.56 28.16,29.45 v1(26.92,30.68)
GND: length 19.5
  Top Layer w0.254: C1.1 81.37,69.82 ME6206a33.1 ; USB1.13 93.4,70.79 USB1.A1B12
  Bottom Layer w0.254: NOREF#10.1 24.26,16.2 v1(24.26,30.68)
  vias: v1(10.21,67.57) v1(13.44,88.81) v1(28.28,51.51) v1(29.25,44.61) v1(36.34,51.76)
VIN: length 78.8
  Top Layer w0.254: 33.27,51.51 34.41,52.65 44.42,52.65 47.98,56.2 47.98,59.74 49.4,61.16 v1(66.83,61.16) ; 92.63,72.34 91.57,72.34 90.17,73.73 90.17,76.27 91.05,77.15 USB1.B4A9 ; 92.63,72.34 92.42,72.13 91.95,72.13 91.79,71.96 91.79,71.5 86.28,65.99 H1.6 ; 92.63,72.34 USB1.A4B9
  Bottom Layer w0.254: v1(66.83,61.16) 70.74,61.16 H1.6
ADC: length 24.2
  Top Layer w0.254: U5.2 22.61,55.83 22.61,51.38 24.38,49.6 37.35,49.6 R16.2 R15.1
BATTERY+: length 120.5
  Top Layer w0.254: 70.88,73.1 75.56,68.42 75.56,67.65 74.39,66.47 74.39,65.5 75.26,64.63 76.05,64.63 76.74,63.93 76.74,60.42 75.56,59.24 75.56,58.37 ; 70.88,73.1 CN1.1 ; 70.88,73.1 ME6206a33.3 78.9,70.84 79.56,70.18 C1.2 ; rr.2 41.66,68.25 rf.2 ; lf.2 41.78,60.84 42.8,61.86 67.75,61.86 69.53,60.08 v1(69.53,57.79) 67.56,59.76 49.01,59.76 48.69,59.44 48.69,55.49 45.11,51.91 41.16,51.91 R16.1
  Bottom Layer w0.254: v1(69.53,57.79) 74.99,57.79 75.56,58.37 ; rr.2 41.66,60.65 lf.2 41.78,56.66 lr.2
D0_IO16: length 25.4
  Bottom Layer w0.254: 44.12,68.2 42.29,66.37 32,66.37 26.54,60.91 v1(26.54,56.08)
D1_IO5: length 26.7
  Bottom Layer w0.254: v1(24.51,70.43) 25.27,69.67 45.09,69.67 45.47,69.29 45.47,65.86 rr.1
D2_IO4: length 30
  Bottom Layer w0.254: 26.54,70.94 27.18,70.3 45.47,70.3 45.97,69.8 45.97,64.16 44.32,62.51 44.32,60.4
  vias: v1(26.33,71)
D3_IO0: length 56
  Top Layer w0.254: v1(27.57,75.13) 28.54,74.16 U5.12
  Bottom Layer w0.254: v1(27.57,75.13) 27.57,79.43 20.98,86.03 20.98,86.17 FLASH.2 ; 44.39,56.46 46.35,58.43 46.35,70.43 45.72,71.07 v1(28.45,71.07)
D4_IO2: length 15.6
  Top Layer w0.254: U5.11 30.73,71.18 R7.2 29.71,76.15 28.7,76.15 28.65,76.2 25.88,76.2 24.23,74.55 21.7,74.55 20.99,75.26 R14.1
D5_IO14: length 89.9
  Top Layer w0.254: U6.3 29.34,2.99 NOREF.1 ; U5.5 28.19,56.24 28.19,57.86 28.01,58.04 16.69,58.04 10.54,51.89 5.97,51.89 4.57,53.29 4.57,61.41 5.46,62.3 v1(6.43,62.3) 6.43,62.35 NOREF#21.1
  Bottom Layer w0.254: v1(10.21,62.49) 10.41,62.28 10.41,53.41 9.91,52.91 7.11,52.91 6.35,53.67 6.35,62.23 v1(6.43,62.3)
  vias: v1(29.49,30.68)
D6_IO12: length 67.2
  Top Layer w0.254: NOREF#6.1 6.35,53.67 7.11,52.91 9.27,52.91 10.21,53.84 NOREF#14.1 26.83,59.95 29.52,57.26 29.52,56.92 U5.6 ; U6.4 31.62,30.43 NOREF#2.1
  vias: v1(31.86,30.43)
D7_IO13: length 6.6
  Top Layer w0.254: U5.7 32.01,55.36 32.01,51.76 31.76,51.51 R18.2
D8_IO15: length 10.9
  Top Layer w0.254: U5.10 32.54,72.11 34.16,73.73 34.16,75.02 R6.2 36.83,77.8 R19.2
P1: length 40.2
  Bottom Layer w0.254: NOREF#12.1 33.58,13.23 33.58,1.27 33.4,1.09 25.65,1.09 U6.1 23.5,2.74 21.21,5.03 NOREF#19.1
P2: length 13.1
  Bottom Layer w0.254: NOREF#11.1 26.54,15.31 U6.2
RST: length 18.8
  Bottom Layer w0.254: v1(20.54,55.89) 17.65,53 17.65,38.29 RST.1
RXD: length 96.5
  Top Layer w0.254: v1(92.07,68.91) 80.26,57.1 74.04,57.1 68.33,62.81 37.97,62.81 37.34,63.45 23.88,63.45 23.06,64.26 23.06,70.48 U5.15 ; USB1.B6 94.37,75.5 94.49,75.38 v1(94.49,74.68) 94.31,74.5 USB1.A6
  Bottom Layer w0.254: v1(94.49,74.68) 94.87,74.3 94.87,69.92 93.85,68.91 v1(92.07,68.91)
SERVOS_POWER: length 17.4
  Top Layer w0.254: lr.3 39.24,56.66 lf.3 ; Q1.3 39.88,69.16 rf.3 39.04,64.67 rr.3
  Bottom Layer w0.254: lf.3 39.24,64.46 rr.3
TXD: length 103.8
  Top Layer w0.254: 94.74,73.48 94.73,73.47 94.73,70.1 80.08,55.45 76.85,55.45 76.05,54.65 75.08,54.65 74.39,55.34 74.39,55.99 67.94,62.43 37.78,62.43 36.81,61.46 34.88,61.46 33.91,62.43 22.61,62.43 20.54,64.49 U5.16 ; 94.74,73.48 95.76,74.5 95.76,75.51 94.77,76.5 USB1.B5 ; 94.74,73.48 92.66,73.48 USB1.A5
$1N396: length 4.4
  Top Layer w0.254: R5.2 24.65,55.79 U5.3
$1N3573: length 15
  Top Layer w0.254: LED2.4 22.35,84.78 14.41,84.78 LED1.2
$1N3873: length 18.1
  Top Layer w0.254: LED3.4 40.38,83.81 LED2.2
$1N3945: length 18.1
  Top Layer w0.254: LED3.2 59.61,83.86 LED4.4
$1N4017: length 19.1
  Top Layer w0.254: LED4.2 72.61,88.86 LED5.4
$1N4422: length 140.1
  Top Layer w0.254: LED6.4 2.92,52 2.92,86.69 6.78,90.55 17.13,90.55 17.18,90.6 18.07,90.6 18.28,90.39 19.62,90.39 19.83,90.6 21.17,90.6 21.23,90.55 88.72,90.55 88.9,90.37 88.9,85.34 LED5.2
$1N4734: length 15
  Top Layer w0.254: LED6.2 21.25,39.61 LED7.4
$1N4744: length 19.3
  Top Layer w0.254: LED8.4 45.36,45.14 45.5,45.14 45.59,45.04 45.59,44.9 40.3,39.61 LED7.2
$1N4754: length 18.2
  Top Layer w0.254: LED8.2 59.89,39.86 LED9.4
$1N4764: length 18.8
  Top Layer w0.254: LED10.4 78.81,39.36 LED9.2
$1N4854: length 21.8
  Top Layer w0.254: LED1.4 11.94,87.31 11.94,80.72 17.4,75.26 19.48,75.26 20.19,75.97 21.23,75.97 21.94,75.26 R14.2
$1N12611: length 2.4
  Top Layer w0.254: R19.1 40.83,77.6 Q1.1

## Copper pours and planes (outline as drawn; the poured copper is in the pictures)
GND on Top Layer: -40.13,139.39 170.56,139.39 170.56,-2.97 -40.13,-2.97
GND on Bottom Layer: -30.35,110.44 182.12,110.44 182.12,-35.74 -30.35,-35.74

## Text on the board
Bottom Silkscreen Layer: 3V3 | D5 | D6 | GND | P1 | P2 | DATA | - | +
Top Silkscreen Layer: GND | 3V3 | D5 | D6 | P1 | P2 | charging / module
